# EAGLE schematic programmer-E01 (EAGLE 7.4.0)
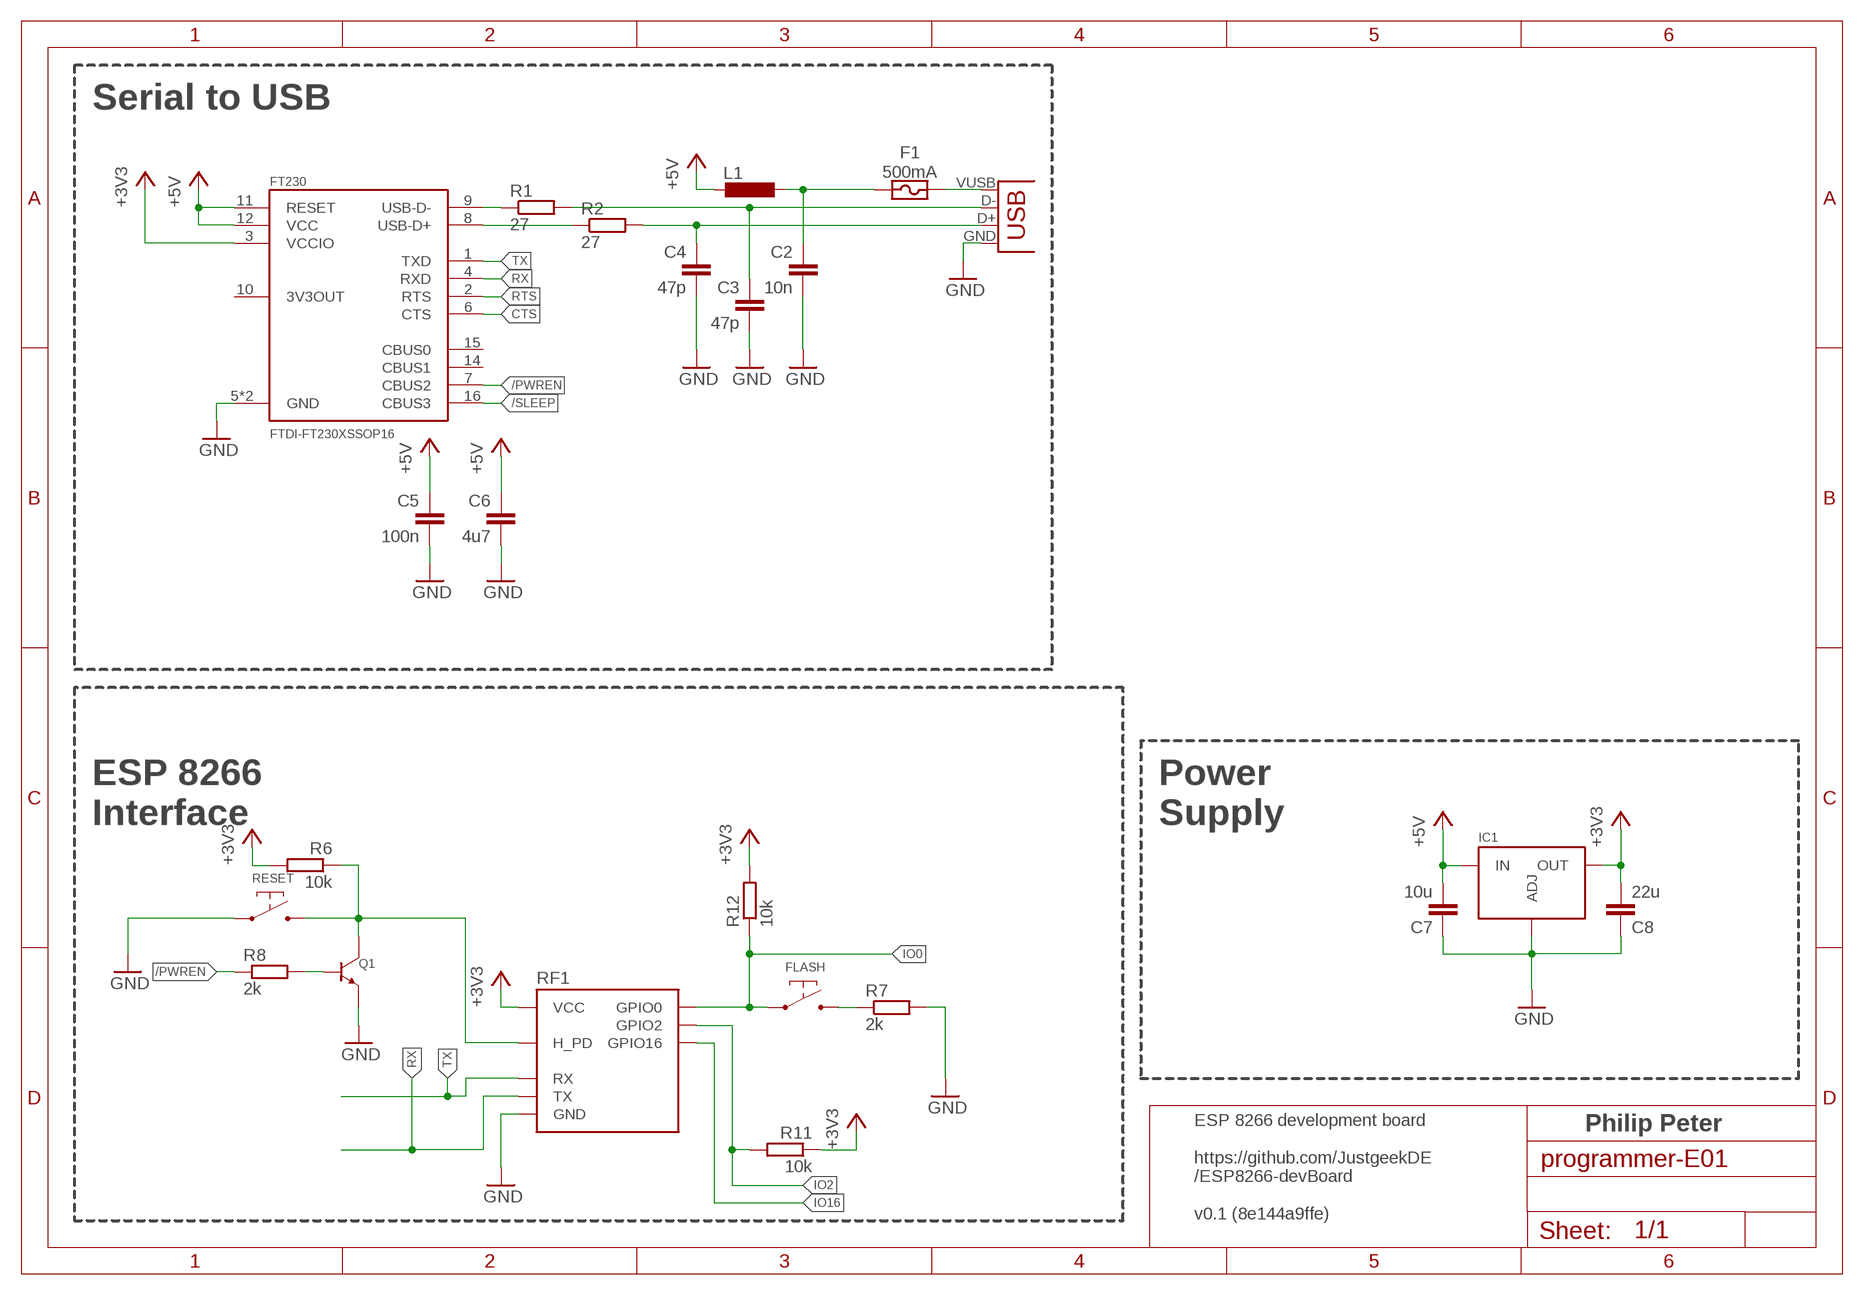
[diagram p0: schematic, sheet 1]

## Parts
C2  10n  C-EUC0805  [C0805]
C3  47p  C-EUC0805  [C0805]
C4  47p  C-EUC0805  [C0805]
C5  100n  C-EUC0805  [C0805]
C6  4u7  C-EUC0805  [C0805]
C7  10u  C-EUC0805  [C0805]
C8  22u  C-EUC0805  [C0805]
CON1  USBMICRO-NO_CENTER-LONG_PADS  [USB-MICRO-SMD-NO_CENTER-LONG_PADS]
F1  500mA  FUSE0805  [SMD-FUSE-0805]
FLASH  SWITCH-DEFAULT_OFF-2PIN  [SWITCH-GENERIC-2_PIN]
FT230  FTDI-FT230XSSOP16  [SSOP-16-FTDI]
IC1  REGULATOR-LM317-SOT223  [SOT223]
L1  875-MI0805K601R-10  INDUCTOR0805  [R0805]
Q1  TRANSISTOR-NPN-GENERIC-SOT23-BEC  [SOT23]
R1  27  R-EU_R0805  [R0805]
R2  27  R-EU_R0805  [R0805]
R6  10k  R-EU_R0805  [R0805]
R7  2k  R-EU_R0805  [R0805]
R8  2k  R-EU_R0805  [R0805]
R11  10k  R-EU_R0805  [R0805]
R12  10k  R-EU_R0805  [R0805]
RESET  SWITCH-DEFAULT_OFF-2PIN  [SWITCH-GENERIC-2_PIN]
RF1  ESP2866-ESP-01THT  [ESP8266-ESP-01]

## Nets
+3V3: C8.2 FT230.3(VCCIO) IC1.2(OUT) IC1.4(OUT) R6.2 R11.1 R12.2 RF1.VCC
+5V: C5.1 C6.1 C7.2 FT230.11(RESET) FT230.12(VCC) IC1.3(IN) L1.2
/PWREN: FT230.7(CBUS2) R8.1
/SLEEP: FT230.16(CBUS3)
CTS: FT230.6(CTS)
GND: C2.2 C3.2 C4.2 C5.2 C6.2 C7.1 C8.1 CON1.GND FT230.5(GND) FT230.13(GND) IC1.1(ADJ) Q1.P$2(EMITTER) R7.2 RESET.P$1 RF1.GND
IO0: FLASH.P$1 R12.1 RF1.GPIO0
IO2: R11.2 RF1.GPIO2
IO16: RF1.GPIO16
N$1: Q1.P$1(BASE) R8.2
N$2: C2.1 F1.1 L1.1
N$4: C3.1 CON1.D- R1.2
N$5: FT230.9(USB-D-) R1.1
N$6: FT230.8(USB-D+) R2.1
N$7: C4.1 CON1.D+ R2.2
N$11: FLASH.P$2 R7.1
N$18: CON1.VUSB(VBUS) F1.2
RESET: Q1.P$3(COLLECTOR) R6.1 RESET.P$2 RF1.H_PD
RTS: FT230.2(RTS)
RX: FT230.4(RXD) RF1.TX
TX: FT230.1(TXD) RF1.RX
Unconnected: FT230.10(3V3OUT) FT230.14(CBUS1) FT230.15(CBUS0)

## Notes on the sheet
- Serial to USB
- ESP 8266
  Interface
- Power
  Supply
- ESP 8266 development board
  
  https://github.com/JustgeekDE
  /ESP8266-devBoard
  
  v0.1 (8e144a9ffe)
- Philip Peter

## Library data of the parts
C2-C8 = p.peter-rcl:C-EU: CAPACITOR, European symbol
CON1 = p.peter-connectors:USB
F1 = p.peter-regulators:FUSE
FLASH RESET = p.peter-passives:SWITCH-DEFAULT_OFF
FT230 = p.peter-ics:FTDI-FT230X
IC1 = p.peter-regulators:REGULATOR-LM317
L1 = p.peter-passives:INDUCTOR
Q1 = p.peter-ics:TRANSISTOR-NPN-GENERIC
R1 R2 R6-R8 R11 R12 = p.peter-rcl:R-EU_: RESISTOR, European symbol
RF1 = p.peter-periphery:ESP2866-ESP-01